# Altium schematic sheet TS_Measurement_Circuit.SchDoc
size A4; SheetNumber: 1; SheetTotal: 2
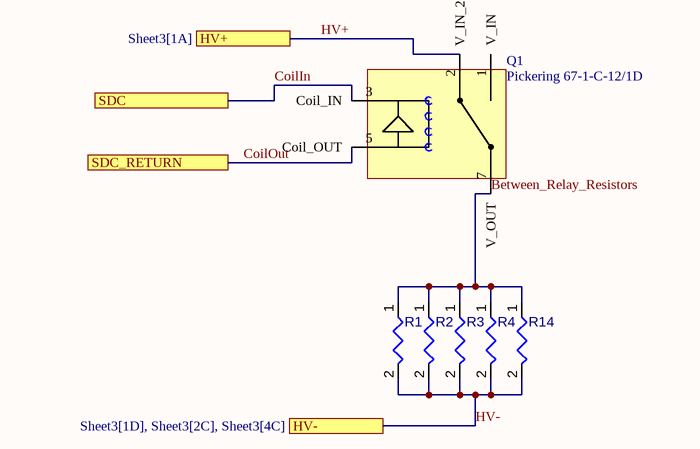
[diagram p0: TS_Measurement_Circuit.SchDoc]

## Parts
Q1  Pickering 67-1-C-12/1D
R1  RH02530K00FC02  (value not drawn)
R2  RH02530K00FC02  (value not drawn)
R3  RH02530K00FC02  (value not drawn)
R4  RH02530K00FC02  (value not drawn)
R14  RH02530K00FC02  (value not drawn)

## Ports
HV+ (see Sheet3[1A]), HV- (see Sheet3[1D], Sheet3[2C], Sheet3[4C]), SDC, SDC_RETURN

## Nets
Between_Relay_Resistors: R1.1 R2.1 R3.1 R4.1 R14.1
CoilIn: port SDC
CoilOut: port SDC_RETURN
HV+: port HV+
HV-: R1.2 R2.2 R3.2 R4.2 R14.2 ; port HV-

Not connected (* = marked no-connect by the designer): Q1 1(V_IN) 2(V_IN_2) 3(Coil_IN) 5(Coil_OUT) 7(V_OUT)

## Library data of the parts
Q1 = CMP-008-00012-5: https://www.pickeringrelay.com/pdfs/67-68-high-voltage-reed-relays.pdf
R1-R4 R14 = CMP-009-00181-1: 30 kΩ, 25 W, 800 V